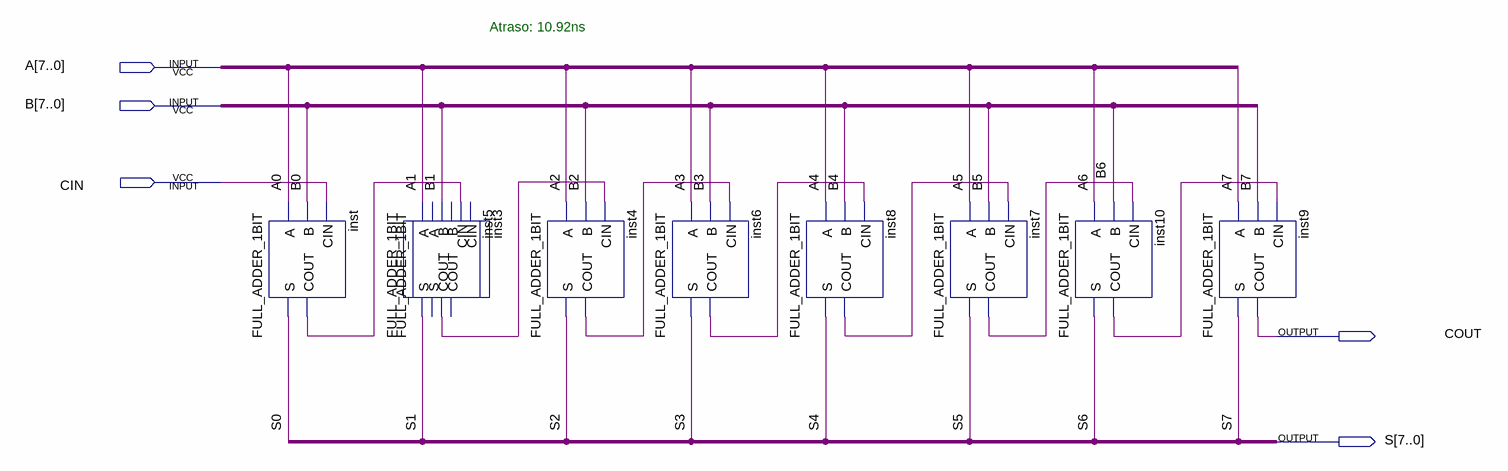
[diagram p0: schematic sheet]
// Quartus schematic FULL_ADDER_8BIT.bdf as structural Verilog: 9 symbols, 5 pins
module FULL_ADDER_8BIT (
  input  [7:0] A,
  input  [7:0] B,
  input  CIN,
  output COUT,
  output [7:0] S
);

  wire inst4_cout, inst5_cout, inst6_cout, inst7_cout, inst8_cout, inst10_cout, inst_cout;

  FULL_ADDER_1BIT inst (.A(A[0]), .B(B[0]), .CIN(CIN), .S(S[0]), .COUT(inst_cout));
  FULL_ADDER_1BIT inst3 ();  // open: A, B, CIN, S, COUT
  FULL_ADDER_1BIT inst5 (.A(A[1]), .B(B[1]), .CIN(inst_cout), .S(S[1]), .COUT(inst5_cout));
  FULL_ADDER_1BIT inst4 (.A(A[2]), .B(B[2]), .CIN(inst5_cout), .S(S[2]), .COUT(inst4_cout));
  FULL_ADDER_1BIT inst6 (.A(A[3]), .B(B[3]), .CIN(inst4_cout), .S(S[3]), .COUT(inst6_cout));
  FULL_ADDER_1BIT inst8 (.A(A[4]), .B(B[4]), .CIN(inst6_cout), .S(S[4]), .COUT(inst8_cout));
  FULL_ADDER_1BIT inst7 (.A(A[5]), .B(B[5]), .CIN(inst8_cout), .S(S[5]), .COUT(inst7_cout));
  FULL_ADDER_1BIT inst10 (.A(A[6]), .B(B[6]), .CIN(inst7_cout), .S(S[6]), .COUT(inst10_cout));
  FULL_ADDER_1BIT inst9 (.A(A[7]), .B(B[7]), .CIN(inst10_cout), .S(S[7]), .COUT(COUT));

  // Notes on the sheet:
  //   Atraso: 10.92ns
endmodule
